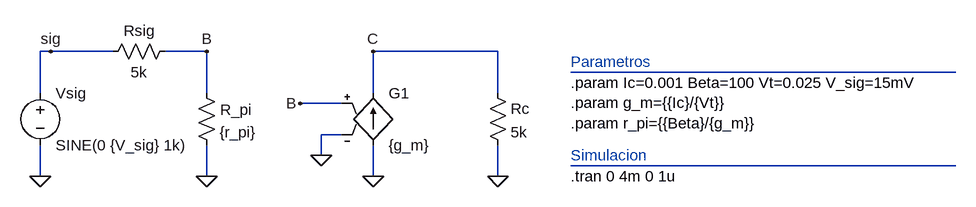
[diagram p0: schematic EC_ejemplo1_parte1.asc]
EC_ejemplo1_parte1.asc, the LTspice schematic file:
Version 4
SHEET 1 1220 680
WIRE -464 -32 -480 -32
WIRE -368 -32 -464 -32
WIRE -224 -32 -288 -32
WIRE 224 -32 32 -32
WIRE 928 0 336 0
WIRE -480 32 -480 -32
WIRE -224 32 -224 -32
WIRE 32 32 32 -32
WIRE 224 32 224 -32
WIRE -16 48 -80 48
WIRE -16 96 -48 96
WIRE -48 128 -48 96
WIRE 928 144 336 144
WIRE -480 160 -480 112
WIRE -224 160 -224 112
WIRE 32 160 32 112
WIRE 224 160 224 112
FLAG -480 160 0
FLAG -224 160 0
FLAG 32 160 0
FLAG 224 160 0
FLAG -224 -32 B
FLAG 32 -32 C
FLAG -80 48 B
FLAG -48 128 0
FLAG -464 -32 sig
SYMBOL voltage -480 16 R0
WINDOW 123 0 0 Left 0
WINDOW 39 0 0 Left 0
SYMATTR InstName Vsig
SYMATTR Value SINE(0 {V_sig} 1k)
SYMBOL res -240 16 R0
WINDOW 0 37 42 Left 2
SYMATTR InstName R_pi
SYMATTR Value {r_pi}
SYMBOL g 32 16 R0
SYMATTR InstName G1
SYMATTR Value {g_m}
SYMBOL res 208 16 R0
SYMATTR InstName Rc
SYMATTR Value 5k
SYMBOL res -384 -16 R270
WINDOW 0 32 56 VTop 2
WINDOW 3 0 56 VBottom 2
SYMATTR InstName Rsig
SYMATTR Value 5k
TEXT 336 16 Left 2 !.param Ic=0.001 Beta=100 Vt=0.025 V_sig=15mV\n.param g_m={{Ic}/{Vt}}\n.param r_pi={{Beta}/{g_m}}
TEXT 336 160 Left 2 !.tran 0 4m 0 1u
TEXT 336 -16 Left 2 ;Parametros
TEXT 336 128 Left 2 ;Simulacion

The netlist it stands for:
* EC_ejemplo1_parte1.asc
Vsig sig 0 SINE(0 {V_sig} 1k)
R_pi B 0 {r_pi}
G1 0 C B 0 {g_m}
Rc C 0 5k
Rsig sig B 5k
.param Ic=0.001 Beta=100 Vt=0.025 V_sig=15mV
.param g_m={{Ic}/{Vt}}
.param r_pi={{Beta}/{g_m}}
.tran 0 4m 0 1u
* Parametros
* Simulacion
.backanno
.end